# EAGLE schematic atmega (EAGLE 7.6.0)
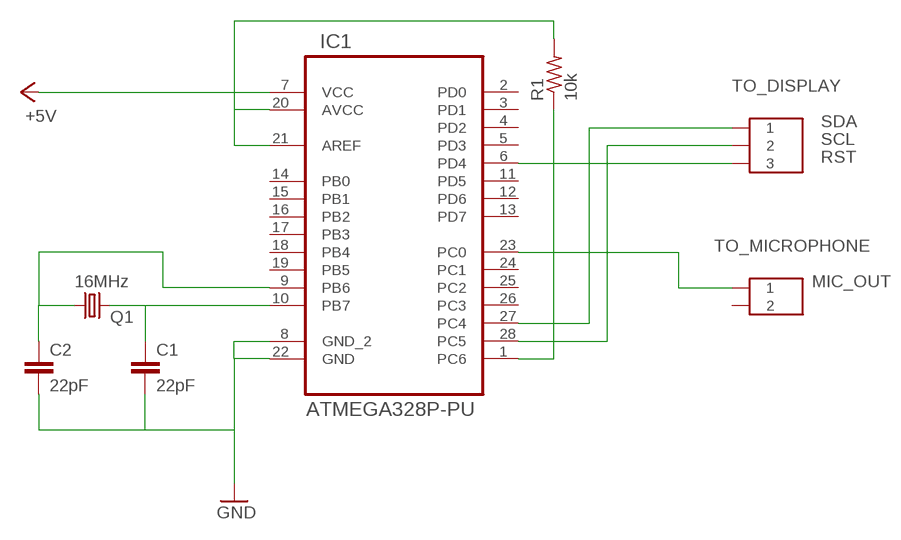
[diagram p0: schematic, sheet 1]

## Parts
C1  22pF  C-EU025-024X044  [C025-024X044]
C2  22pF  C-EU025-024X044  [C025-024X044]
IC1  ATMEGA328P-PU  [DIP254P762X457-28]
Q1  16MHz  CRYSTAL68SMX  [86SMX]
R1  10k  R-US_0204/2V  [0204V]
TO_DISPLAY  EZG-00-303  [EZG-00-303]
TO_MICROPHONE  EZG-00-302  [EZG-00-302]

## Nets
+5V: IC1.7(VCC) IC1.20(AVCC) IC1.21(AREF) R1.2
GND: C1.2 C2.2 IC1.8(GND_2) IC1.22(GND)
N$1: IC1.1(PC6) R1.1
N$2: C2.1 IC1.9(PB6) Q1.1
N$3: C1.1 IC1.10(PB7) Q1.4
N$4: IC1.23(PC0) TO_MICROPHONE.1
N$6: IC1.27(PC4) TO_DISPLAY.1
N$7: IC1.28(PC5) TO_DISPLAY.2
N$8: IC1.6(PD4) TO_DISPLAY.3
Unconnected: IC1.2(PD0) IC1.3(PD1) IC1.4(PD2) IC1.5(PD3) IC1.11(PD5) IC1.12(PD6) IC1.13(PD7) IC1.14(PB0) IC1.15(PB1) IC1.16(PB2) IC1.17(PB3) IC1.18(PB4) IC1.19(PB5) IC1.24(PC1) IC1.25(PC2) IC1.26(PC3) TO_MICROPHONE.2

## Library data of the parts
C1 C2 = rcl:C-EU: CAPACITOR, European symbol
IC1 = Atmel_By_element14_Batch_1-00:ATMEGA328P-PU: 8-bit Microcontroller with In-System Programmable Flash; MPN: ATMEGA328P-PU; OC_FARNELL: 1715487; OC_NEWARK: 15R0268; PACKAGE: PDIP-28; SUPPLIER: Atmel
Q1 = crystal:CRYSTAL: CRYSTAL; OC_FARNELL: 6344860; OC_NEWARK: unknown
R1 = rcl:R-US_: RESISTOR, American symbol
TO_DISPLAY = con-lemo:EZG-?-303: LEMO Connector Source: http://www.lemo.com/pdfs/catalog/ROW/German/unipole_multipole.pdf; OC_FARNELL: unknown; OC_NEWARK: unknown
TO_MICROPHONE = con-lemo:EZG-?-302: LEMO Connector Source: http://www.lemo.com/pdfs/catalog/ROW/German/unipole_multipole.pdf; OC_FARNELL: unknown; OC_NEWARK: unknown